# Altium schematic sheet DDR4_260PIN_Connector.SchDoc
size A3; Date: 07.08.2025; CheckedBy: Own Check; CompanyName: No Company; DocumentNumber: ELK.PCB.0005.0005.A.A; Revision: V0.0.1; SheetNumber: 19; SheetTotal: 22
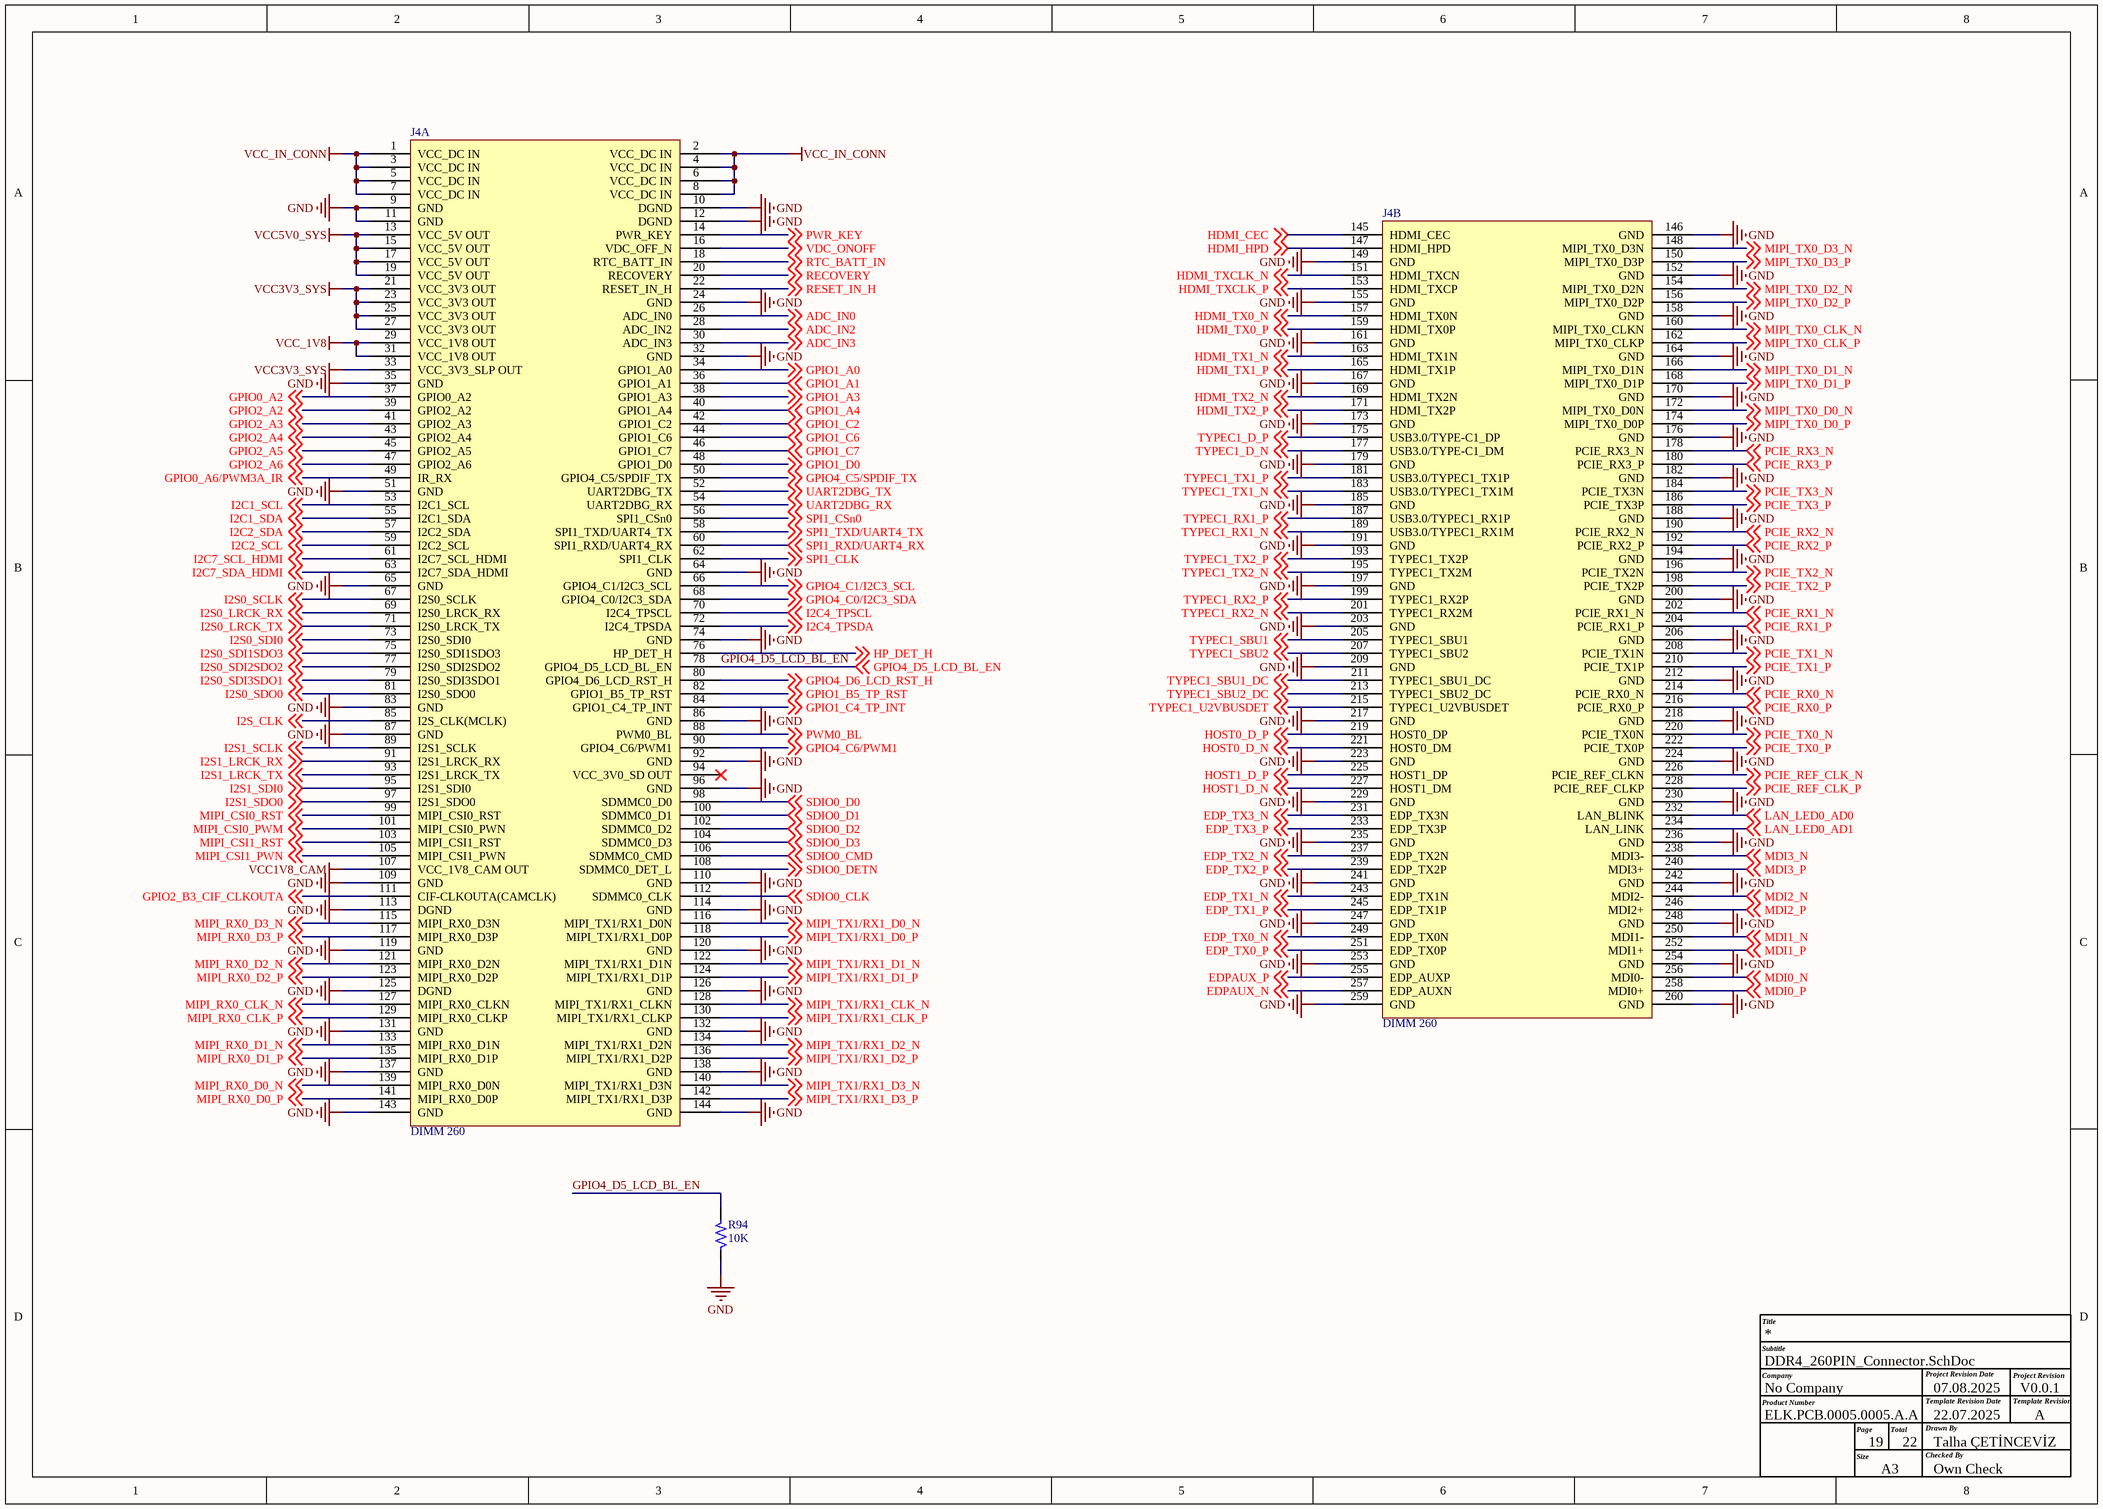
[diagram p0: DDR4_260PIN_Connector.SchDoc]

## Parts
J4  DIMM 260  [DIMM260_DDR4]  (parts A,B of 2)
R94  10K  [RES_0402]

## Nets
GND: J4.9(GND) J4.10(DGND) J4.11(GND) J4.12(DGND) J4.24(GND) J4.32(GND) J4.35(GND) J4.51(GND) J4.64(GND) J4.65(GND) J4.74(GND) J4.83(GND) J4.86(GND) J4.87(GND) J4.92(GND) J4.96(GND) J4.109(GND) J4.110(GND) J4.113(DGND) J4.114(GND) J4.119(GND) J4.120(GND) J4.125(DGND) J4.126(GND) J4.131(GND) J4.132(GND) J4.137(GND) J4.138(GND) J4.143(GND) J4.144(GND) J4.146(GND) J4.149(GND) J4.152(GND) J4.155(GND) J4.158(GND) J4.161(GND) J4.164(GND) J4.167(GND) J4.170(GND) J4.173(GND) J4.176(GND) J4.179(GND) J4.182(GND) J4.185(GND) J4.188(GND) J4.191(GND) J4.194(GND) J4.197(GND) J4.200(GND) J4.203(GND) J4.206(GND) J4.209(GND) J4.212(GND) J4.217(GND) J4.218(GND) J4.223(GND) J4.224(GND) J4.229(GND) J4.230(GND) J4.235(GND) J4.236(GND) J4.241(GND) J4.242(GND) J4.247(GND) J4.248(GND) J4.253(GND) J4.254(GND) J4.259(GND) J4.260(GND) R94.1
VCC1V8_CAM: J4.107(VCC_1V8_CAM_OUT)
VCC3V3_SYS: J4.21(VCC_3V3_OUT) J4.23(VCC_3V3_OUT) J4.25(VCC_3V3_OUT) J4.27(VCC_3V3_OUT) J4.33(VCC_3V3_SLP_OUT)
VCC5V0_SYS: J4.13(VCC_5V_OUT) J4.15(VCC_5V_OUT) J4.17(VCC_5V_OUT) J4.19(VCC_5V_OUT)
VCC_1V8: J4.29(VCC_1V8_OUT) J4.31(VCC_1V8_OUT)
VCC_IN_CONN: J4.1(VCC_DC_IN) J4.2(VCC_DC_IN) J4.3(VCC_DC_IN) J4.4(VCC_DC_IN) J4.5(VCC_DC_IN) J4.6(VCC_DC_IN) J4.7(VCC_DC_IN) J4.8(VCC_DC_IN)
ADC_IN0: J4.26(ADC_IN0) ; off-sheet ADC_IN0
ADC_IN2: J4.28(ADC_IN2) ; off-sheet ADC_IN2
ADC_IN3: J4.30(ADC_IN3) ; off-sheet ADC_IN3
EDP_TX0_N: J4.249(EDP_TX0N) ; off-sheet EDP_TX0_N
EDP_TX0_P: J4.251(EDP_TX0P) ; off-sheet EDP_TX0_P
EDP_TX1_N: J4.243(EDP_TX1N) ; off-sheet EDP_TX1_N
EDP_TX1_P: J4.245(EDP_TX1P) ; off-sheet EDP_TX1_P
EDP_TX2_N: J4.237(EDP_TX2N) ; off-sheet EDP_TX2_N
EDP_TX2_P: J4.239(EDP_TX2P) ; off-sheet EDP_TX2_P
EDP_TX3_N: J4.231(EDP_TX3N) ; off-sheet EDP_TX3_N
EDP_TX3_P: J4.233(EDP_TX3P) ; off-sheet EDP_TX3_P
EDPAUX_N: J4.257(EDP_AUXN) ; off-sheet EDPAUX_N
EDPAUX_P: J4.255(EDP_AUXP) ; off-sheet EDPAUX_P
GPIO0_A2: J4.37(GPIO0_A2) ; off-sheet GPIO0_A2
GPIO0_A6/PWM3A_IR: J4.49(IR_RX) ; off-sheet GPIO0_A6/PWM3A_IR
GPIO1_A0: J4.34(GPIO1_A0) ; off-sheet GPIO1_A0
GPIO1_A1: J4.36(GPIO1_A1) ; off-sheet GPIO1_A1
GPIO1_A3: J4.38(GPIO1_A3) ; off-sheet GPIO1_A3
GPIO1_A4: J4.40(GPIO1_A4) ; off-sheet GPIO1_A4
GPIO1_B5_TP_RST: J4.82(GPIO1_B5_TP_RST) ; off-sheet GPIO1_B5_TP_RST
GPIO1_C2: J4.42(GPIO1_C2) ; off-sheet GPIO1_C2
GPIO1_C4_TP_INT: J4.84(GPIO1_C4_TP_INT) ; off-sheet GPIO1_C4_TP_INT
GPIO1_C6: J4.44(GPIO1_C6) ; off-sheet GPIO1_C6
GPIO1_C7: J4.46(GPIO1_C7) ; off-sheet GPIO1_C7
GPIO1_D0: J4.48(GPIO1_D0) ; off-sheet GPIO1_D0
GPIO2_A2: J4.39(GPIO2_A2) ; off-sheet GPIO2_A2
GPIO2_A3: J4.41(GPIO2_A3) ; off-sheet GPIO2_A3
GPIO2_A4: J4.43(GPIO2_A4) ; off-sheet GPIO2_A4
GPIO2_A5: J4.45(GPIO2_A5) ; off-sheet GPIO2_A5
GPIO2_A6: J4.47(GPIO2_A6) ; off-sheet GPIO2_A6
GPIO2_B3_CIF_CLKOUTA: J4.111(CIF-CLKOUTA(CAMCLK)) ; off-sheet GPIO2_B3_CIF_CLKOUTA
GPIO4_C0/I2C3_SDA: J4.68(GPIO4_C0/I2C3_SDA) ; off-sheet GPIO4_C0/I2C3_SDA
GPIO4_C1/I2C3_SCL: J4.66(GPIO4_C1/I2C3_SCL) ; off-sheet GPIO4_C1/I2C3_SCL
GPIO4_C5/SPDIF_TX: J4.50(GPIO4_C5/SPDIF_TX) ; off-sheet GPIO4_C5/SPDIF_TX
GPIO4_C6/PWM1: J4.90(GPIO4_C6/PWM1) ; off-sheet GPIO4_C6/PWM1
GPIO4_D5_LCD_BL_EN: J4.78(GPIO4_D5_LCD_BL_EN) R94.2 ; off-sheet GPIO4_D5_LCD_BL_EN
GPIO4_D6_LCD_RST_H: J4.80(GPIO4_D6_LCD_RST_H) ; off-sheet GPIO4_D6_LCD_RST_H
HDMI_CEC: J4.145(HDMI_CEC) ; off-sheet HDMI_CEC
HDMI_HPD: J4.147(HDMI_HPD) ; off-sheet HDMI_HPD
HDMI_TX0_N: J4.157(HDMI_TX0N) ; off-sheet HDMI_TX0_N
HDMI_TX0_P: J4.159(HDMI_TX0P) ; off-sheet HDMI_TX0_P
HDMI_TX1_N: J4.163(HDMI_TX1N) ; off-sheet HDMI_TX1_N
HDMI_TX1_P: J4.165(HDMI_TX1P) ; off-sheet HDMI_TX1_P
HDMI_TX2_N: J4.169(HDMI_TX2N) ; off-sheet HDMI_TX2_N
HDMI_TX2_P: J4.171(HDMI_TX2P) ; off-sheet HDMI_TX2_P
HDMI_TXCLK_N: J4.151(HDMI_TXCN) ; off-sheet HDMI_TXCLK_N
HDMI_TXCLK_P: J4.153(HDMI_TXCP) ; off-sheet HDMI_TXCLK_P
HOST0_D_N: J4.221(HOST0_DM) ; off-sheet HOST0_D_N
HOST0_D_P: J4.219(HOST0_DP) ; off-sheet HOST0_D_P
HOST1_D_N: J4.227(HOST1_DM) ; off-sheet HOST1_D_N
HOST1_D_P: J4.225(HOST1_DP) ; off-sheet HOST1_D_P
HP_DET_H: J4.76(HP_DET_H) ; off-sheet HP_DET_H
I2C1_SCL: J4.53(I2C1_SCL) ; off-sheet I2C1_SCL
I2C1_SDA: J4.55(I2C1_SDA) ; off-sheet I2C1_SDA
I2C2_SCL: J4.59(I2C2_SCL) ; off-sheet I2C2_SCL
I2C2_SDA: J4.57(I2C2_SDA) ; off-sheet I2C2_SDA
I2C4_TPSCL: J4.70(I2C4_TPSCL) ; off-sheet I2C4_TPSCL
I2C4_TPSDA: J4.72(I2C4_TPSDA) ; off-sheet I2C4_TPSDA
I2C7_SCL_HDMI: J4.61(I2C7_SCL_HDMI) ; off-sheet I2C7_SCL_HDMI
I2C7_SDA_HDMI: J4.63(I2C7_SDA_HDMI) ; off-sheet I2C7_SDA_HDMI
I2S0_LRCK_RX: J4.69(I2S0_LRCK_RX) ; off-sheet I2S0_LRCK_RX
I2S0_LRCK_TX: J4.71(I2S0_LRCK_TX) ; off-sheet I2S0_LRCK_TX
I2S0_SCLK: J4.67(I2S0_SCLK) ; off-sheet I2S0_SCLK
I2S0_SDI0: J4.73(I2S0_SDI0) ; off-sheet I2S0_SDI0
I2S0_SDI1SDO3: J4.75(I2S0_SDI1SDO3) ; off-sheet I2S0_SDI1SDO3
I2S0_SDI2SDO2: J4.77(I2S0_SDI2SDO2) ; off-sheet I2S0_SDI2SDO2
I2S0_SDI3SDO1: J4.79(I2S0_SDI3SDO1) ; off-sheet I2S0_SDI3SDO1
I2S0_SDO0: J4.81(I2S0_SDO0) ; off-sheet I2S0_SDO0
I2S1_LRCK_RX: J4.91(I2S1_LRCK_RX) ; off-sheet I2S1_LRCK_RX
I2S1_LRCK_TX: J4.93(I2S1_LRCK_TX) ; off-sheet I2S1_LRCK_TX
I2S1_SCLK: J4.89(I2S1_SCLK) ; off-sheet I2S1_SCLK
I2S1_SDI0: J4.95(I2S1_SDI0) ; off-sheet I2S1_SDI0
I2S1_SDO0: J4.97(I2S1_SDO0) ; off-sheet I2S1_SDO0
I2S_CLK: J4.85(I2S_CLK(MCLK)) ; off-sheet I2S_CLK
LAN_LED0_AD0: J4.232(LAN_BLINK) ; off-sheet LAN_LED0_AD0
LAN_LED0_AD1: J4.234(LAN_LINK) ; off-sheet LAN_LED0_AD1
MDI0_N: J4.256(MDI0-) ; off-sheet MDI0_N
MDI0_P: J4.258(MDI0+) ; off-sheet MDI0_P
MDI1_N: J4.250(MDI1-) ; off-sheet MDI1_N
MDI1_P: J4.252(MDI1+) ; off-sheet MDI1_P
MDI2_N: J4.244(MDI2-) ; off-sheet MDI2_N
MDI2_P: J4.246(MDI2+) ; off-sheet MDI2_P
MDI3_N: J4.238(MDI3-) ; off-sheet MDI3_N
MDI3_P: J4.240(MDI3+) ; off-sheet MDI3_P
MIPI_CSI0_PWM: J4.101(MIPI_CSI0_PWN) ; off-sheet MIPI_CSI0_PWM
MIPI_CSI0_RST: J4.99(MIPI_CSI0_RST) ; off-sheet MIPI_CSI0_RST
MIPI_CSI1_PWN: J4.105(MIPI_CSI1_PWN) ; off-sheet MIPI_CSI1_PWN
MIPI_CSI1_RST: J4.103(MIPI_CSI1_RST) ; off-sheet MIPI_CSI1_RST
MIPI_RX0_CLK_N: J4.127(MIPI_RX0_CLKN) ; off-sheet MIPI_RX0_CLK_N
MIPI_RX0_CLK_P: J4.129(MIPI_RX0_CLKP) ; off-sheet MIPI_RX0_CLK_P
MIPI_RX0_D0_N: J4.139(MIPI_RX0_D0N) ; off-sheet MIPI_RX0_D0_N
MIPI_RX0_D0_P: J4.141(MIPI_RX0_D0P) ; off-sheet MIPI_RX0_D0_P
MIPI_RX0_D1_N: J4.133(MIPI_RX0_D1N) ; off-sheet MIPI_RX0_D1_N
MIPI_RX0_D1_P: J4.135(MIPI_RX0_D1P) ; off-sheet MIPI_RX0_D1_P
MIPI_RX0_D2_N: J4.121(MIPI_RX0_D2N) ; off-sheet MIPI_RX0_D2_N
MIPI_RX0_D2_P: J4.123(MIPI_RX0_D2P) ; off-sheet MIPI_RX0_D2_P
MIPI_RX0_D3_N: J4.115(MIPI_RX0_D3N) ; off-sheet MIPI_RX0_D3_N
MIPI_RX0_D3_P: J4.117(MIPI_RX0_D3P) ; off-sheet MIPI_RX0_D3_P
MIPI_TX0_CLK_N: J4.160(MIPI_TX0_CLKN) ; off-sheet MIPI_TX0_CLK_N
MIPI_TX0_CLK_P: J4.162(MIPI_TX0_CLKP) ; off-sheet MIPI_TX0_CLK_P
MIPI_TX0_D0_N: J4.172(MIPI_TX0_D0N) ; off-sheet MIPI_TX0_D0_N
MIPI_TX0_D0_P: J4.174(MIPI_TX0_D0P) ; off-sheet MIPI_TX0_D0_P
MIPI_TX0_D1_N: J4.166(MIPI_TX0_D1N) ; off-sheet MIPI_TX0_D1_N
MIPI_TX0_D1_P: J4.168(MIPI_TX0_D1P) ; off-sheet MIPI_TX0_D1_P
MIPI_TX0_D2_N: J4.154(MIPI_TX0_D2N) ; off-sheet MIPI_TX0_D2_N
MIPI_TX0_D2_P: J4.156(MIPI_TX0_D2P) ; off-sheet MIPI_TX0_D2_P
MIPI_TX0_D3_N: J4.148(MIPI_TX0_D3N) ; off-sheet MIPI_TX0_D3_N
MIPI_TX0_D3_P: J4.150(MIPI_TX0_D3P) ; off-sheet MIPI_TX0_D3_P
MIPI_TX1/RX1_CLK_N: J4.128(MIPI_TX1/RX1_CLKN) ; off-sheet MIPI_TX1/RX1_CLK_N
MIPI_TX1/RX1_CLK_P: J4.130(MIPI_TX1/RX1_CLKP) ; off-sheet MIPI_TX1/RX1_CLK_P
MIPI_TX1/RX1_D0_N: J4.116(MIPI_TX1/RX1_D0N) ; off-sheet MIPI_TX1/RX1_D0_N
MIPI_TX1/RX1_D0_P: J4.118(MIPI_TX1/RX1_D0P) ; off-sheet MIPI_TX1/RX1_D0_P
MIPI_TX1/RX1_D1_N: J4.122(MIPI_TX1/RX1_D1N) ; off-sheet MIPI_TX1/RX1_D1_N
MIPI_TX1/RX1_D1_P: J4.124(MIPI_TX1/RX1_D1P) ; off-sheet MIPI_TX1/RX1_D1_P
MIPI_TX1/RX1_D2_N: J4.134(MIPI_TX1/RX1_D2N) ; off-sheet MIPI_TX1/RX1_D2_N
MIPI_TX1/RX1_D2_P: J4.136(MIPI_TX1/RX1_D2P) ; off-sheet MIPI_TX1/RX1_D2_P
MIPI_TX1/RX1_D3_N: J4.140(MIPI_TX1/RX1_D3N) ; off-sheet MIPI_TX1/RX1_D3_N
MIPI_TX1/RX1_D3_P: J4.142(MIPI_TX1/RX1_D3P) ; off-sheet MIPI_TX1/RX1_D3_P
PCIE_REF_CLK_N: J4.226(PCIE_REF_CLKN) ; off-sheet PCIE_REF_CLK_N
PCIE_REF_CLK_P: J4.228(PCIE_REF_CLKP) ; off-sheet PCIE_REF_CLK_P
PCIE_RX0_N: J4.214(PCIE_RX0_N) ; off-sheet PCIE_RX0_N
PCIE_RX0_P: J4.216(PCIE_RX0_P) ; off-sheet PCIE_RX0_P
PCIE_RX1_N: J4.202(PCIE_RX1_N) ; off-sheet PCIE_RX1_N
PCIE_RX1_P: J4.204(PCIE_RX1_P) ; off-sheet PCIE_RX1_P
PCIE_RX2_N: J4.190(PCIE_RX2_N) ; off-sheet PCIE_RX2_N
PCIE_RX2_P: J4.192(PCIE_RX2_P) ; off-sheet PCIE_RX2_P
PCIE_RX3_N: J4.178(PCIE_RX3_N) ; off-sheet PCIE_RX3_N
PCIE_RX3_P: J4.180(PCIE_RX3_P) ; off-sheet PCIE_RX3_P
PCIE_TX0_N: J4.220(PCIE_TX0N) ; off-sheet PCIE_TX0_N
PCIE_TX0_P: J4.222(PCIE_TX0P) ; off-sheet PCIE_TX0_P
PCIE_TX1_N: J4.208(PCIE_TX1N) ; off-sheet PCIE_TX1_N
PCIE_TX1_P: J4.210(PCIE_TX1P) ; off-sheet PCIE_TX1_P
PCIE_TX2_N: J4.196(PCIE_TX2N) ; off-sheet PCIE_TX2_N
PCIE_TX2_P: J4.198(PCIE_TX2P) ; off-sheet PCIE_TX2_P
PCIE_TX3_N: J4.184(PCIE_TX3N) ; off-sheet PCIE_TX3_N
PCIE_TX3_P: J4.186(PCIE_TX3P) ; off-sheet PCIE_TX3_P
PWM0_BL: J4.88(PWM0_BL) ; off-sheet PWM0_BL
PWR_KEY: J4.14(PWR_KEY) ; off-sheet PWR_KEY
RECOVERY: J4.20(RECOVERY) ; off-sheet RECOVERY
RESET_IN_H: J4.22(RESET_IN_H) ; off-sheet RESET_IN_H
RTC_BATT_IN: J4.18(RTC_BATT_IN) ; off-sheet RTC_BATT_IN
SDIO0_CLK: J4.112(SDMMC0_CLK) ; off-sheet SDIO0_CLK
SDIO0_CMD: J4.106(SDMMC0_CMD) ; off-sheet SDIO0_CMD
SDIO0_D0: J4.98(SDMMC0_D0) ; off-sheet SDIO0_D0
SDIO0_D1: J4.100(SDMMC0_D1) ; off-sheet SDIO0_D1
SDIO0_D2: J4.102(SDMMC0_D2) ; off-sheet SDIO0_D2
SDIO0_D3: J4.104(SDMMC0_D3) ; off-sheet SDIO0_D3
SDIO0_DETN: J4.108(SDMMC0_DET_L) ; off-sheet SDIO0_DETN
SPI1_CLK: J4.62(SPI1_CLK) ; off-sheet SPI1_CLK
SPI1_CSn0: J4.56(SPI1_CSn0) ; off-sheet SPI1_CSn0
SPI1_RXD/UART4_RX: J4.60(SPI1_RXD/UART4_RX) ; off-sheet SPI1_RXD/UART4_RX
SPI1_TXD/UART4_TX: J4.58(SPI1_TXD/UART4_TX) ; off-sheet SPI1_TXD/UART4_TX
TYPEC1_D_N: J4.177(USB3.0/TYPE-C1_DM) ; off-sheet TYPEC1_D_N
TYPEC1_D_P: J4.175(USB3.0/TYPE-C1_DP) ; off-sheet TYPEC1_D_P
TYPEC1_RX1_N: J4.189(USB3.0/TYPEC1_RX1M) ; off-sheet TYPEC1_RX1_N
TYPEC1_RX1_P: J4.187(USB3.0/TYPEC1_RX1P) ; off-sheet TYPEC1_RX1_P
TYPEC1_RX2_N: J4.201(TYPEC1_RX2M) ; off-sheet TYPEC1_RX2_N
TYPEC1_RX2_P: J4.199(TYPEC1_RX2P) ; off-sheet TYPEC1_RX2_P
TYPEC1_SBU1: J4.205(TYPEC1_SBU1) ; off-sheet TYPEC1_SBU1
TYPEC1_SBU1_DC: J4.211(TYPEC1_SBU1_DC) ; off-sheet TYPEC1_SBU1_DC
TYPEC1_SBU2: J4.207(TYPEC1_SBU2) ; off-sheet TYPEC1_SBU2
TYPEC1_SBU2_DC: J4.213(TYPEC1_SBU2_DC) ; off-sheet TYPEC1_SBU2_DC
TYPEC1_TX1_N: J4.183(USB3.0/TYPEC1_TX1M) ; off-sheet TYPEC1_TX1_N
TYPEC1_TX1_P: J4.181(USB3.0/TYPEC1_TX1P) ; off-sheet TYPEC1_TX1_P
TYPEC1_TX2_N: J4.195(TYPEC1_TX2M) ; off-sheet TYPEC1_TX2_N
TYPEC1_TX2_P: J4.193(TYPEC1_TX2P) ; off-sheet TYPEC1_TX2_P
TYPEC1_U2VBUSDET: J4.215(TYPEC1_U2VBUSDET) ; off-sheet TYPEC1_U2VBUSDET
UART2DBG_RX: J4.54(UART2DBG_RX) ; off-sheet UART2DBG_RX
UART2DBG_TX: J4.52(UART2DBG_TX) ; off-sheet UART2DBG_TX
VDC_ONOFF: J4.16(VDC_OFF_N) ; off-sheet VDC_ONOFF

Not connected (* = marked no-connect by the designer): J4 94(VCC_3V0_SD_OUT)*

## Notes on the sheet
- Title
- Company
- Product Number
- Subtitle
- Project Revision Date
- Template Revision Date
- Project Revision
- Template Revision
- Size
- Page
- A3
- Total
- Checked By
- Drawn By
- 22.07.2025
- Talha ÇETİNCEVİZ
- A

## Library data of the parts
J4 = CON-DIMM_260-SMD: Dimm 260 pin smd plating on pcb; Manufacturer: NA; Manufacturer Part Number: NA; Case/Package: NA; Supplier-1: NA
R94 = RES_10K-0.1W-1%-0402: 10 kOhms ±1% 0.1W, 1/10W Chip Resistor 0402 (1005 Metric) Anti-Sulfur Thin Film; Manufacturer: Vishay Beyschlag/Draloric/BC Components; Manufacturer Part Number: MCS04020C1002FE000; Case/Package: 0402; Supplier-1: Digikey